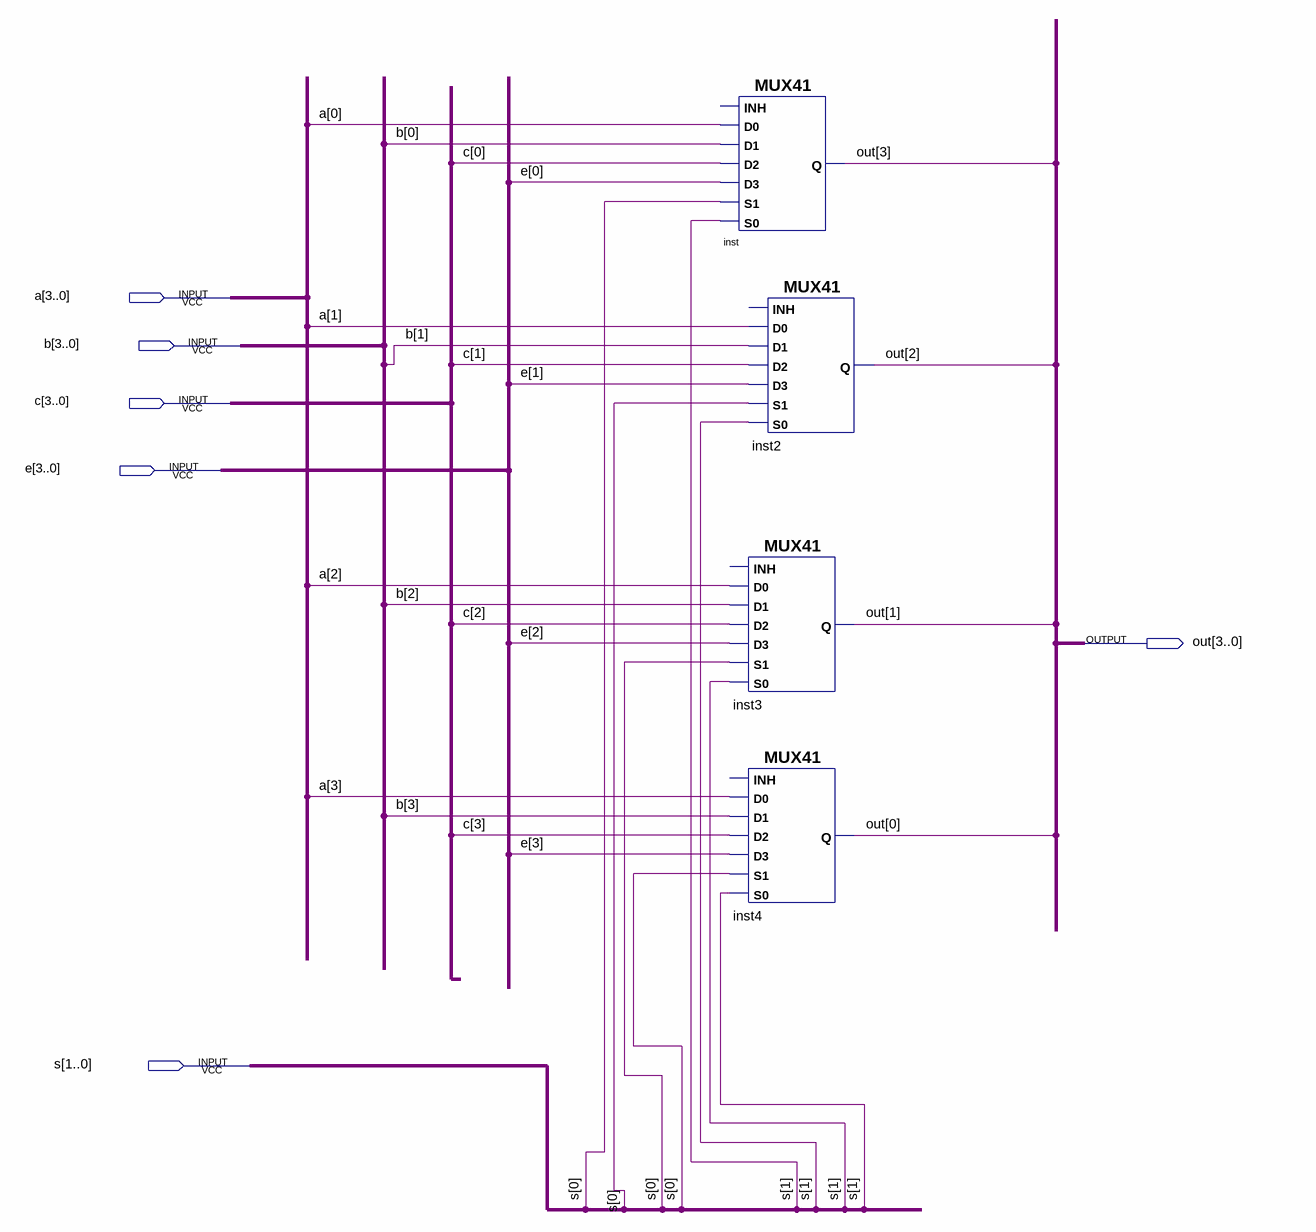
[diagram p0: schematic sheet]
// Quartus schematic Block3.bdf as structural Verilog: 4 symbols, 6 pins
module Block3 (
  input  [3:0] a,
  input  [3:0] b,
  input  [3:0] c,
  input  [3:0] e,
  input  [1:0] s,
  output [3:0] out
);

  MUX41 inst (.S0(s[1]), .D2(c[0]), .S1(s[0]), .D3(e[0]), .D0(a[0]), .D1(b[0]), .Q(out[3]));  // open: INH
  MUX41 inst2 (.S0(s[1]), .D2(c[1]), .S1(s[0]), .D3(e[1]), .D0(a[1]), .D1(b[1]), .Q(out[2]));  // open: INH
  MUX41 inst3 (.S0(s[1]), .D2(c[2]), .S1(s[0]), .D3(e[2]), .D0(a[2]), .D1(b[2]), .Q(out[1]));  // open: INH
  MUX41 inst4 (.S0(s[1]), .D2(c[3]), .S1(s[0]), .D3(e[3]), .D0(a[3]), .D1(b[3]), .Q(out[0]));  // open: INH
endmodule
